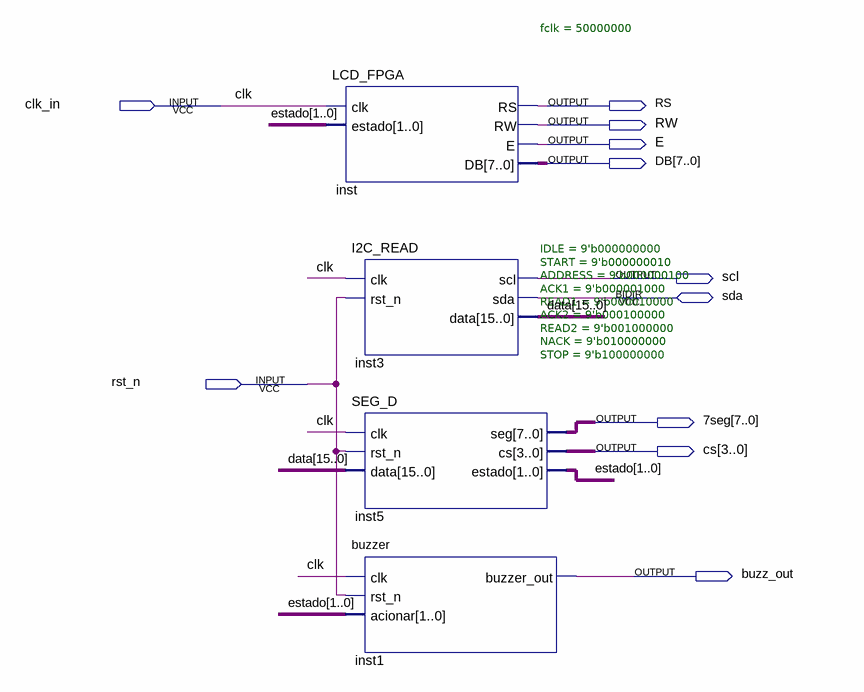
[diagram p0: schematic sheet]
// Quartus schematic proj_block.bdf as structural Verilog: 4 symbols, 11 pins
module proj_block (
  input  clk_in,
  input  rst_n,
  inout  sda,
  output RS,
  output RW,
  output E,
  output [7:0] DB,
  output scl,
  output [7:0] \7seg ,
  output [3:0] cs,
  output buzz_out
);

  wire [1:0] estado;
  wire [15:0] data;

  LCD_FPGA #(.fclk(50000000)) inst (.clk(clk_in), .estado(estado), .RS(RS), .RW(RW), .E(E), .DB(DB));
  I2C_READ #(.IDLE(9'b000000000), .START(9'b000000010), .ADDRESS(9'b000000100), .ACK1(9'b000001000), .READ1(9'b000010000), .ACK2(9'b000100000), .READ2(9'b001000000), .NACK(9'b010000000), .STOP(9'b100000000)) inst3 (
    .clk(clk_in), .rst_n(rst_n), .scl(scl), .data(data), .sda(sda));
  SEG_D inst5 (.clk(clk_in), .rst_n(rst_n), .data(data), .seg(\7seg ), .cs(cs), .estado(estado));
  buzzer inst1 (.clk(clk_in), .rst_n(rst_n), .acionar(estado), .buzzer_out(buzz_out));

  // Other names for the same wires on the sheet: clk = clk_in
endmodule
